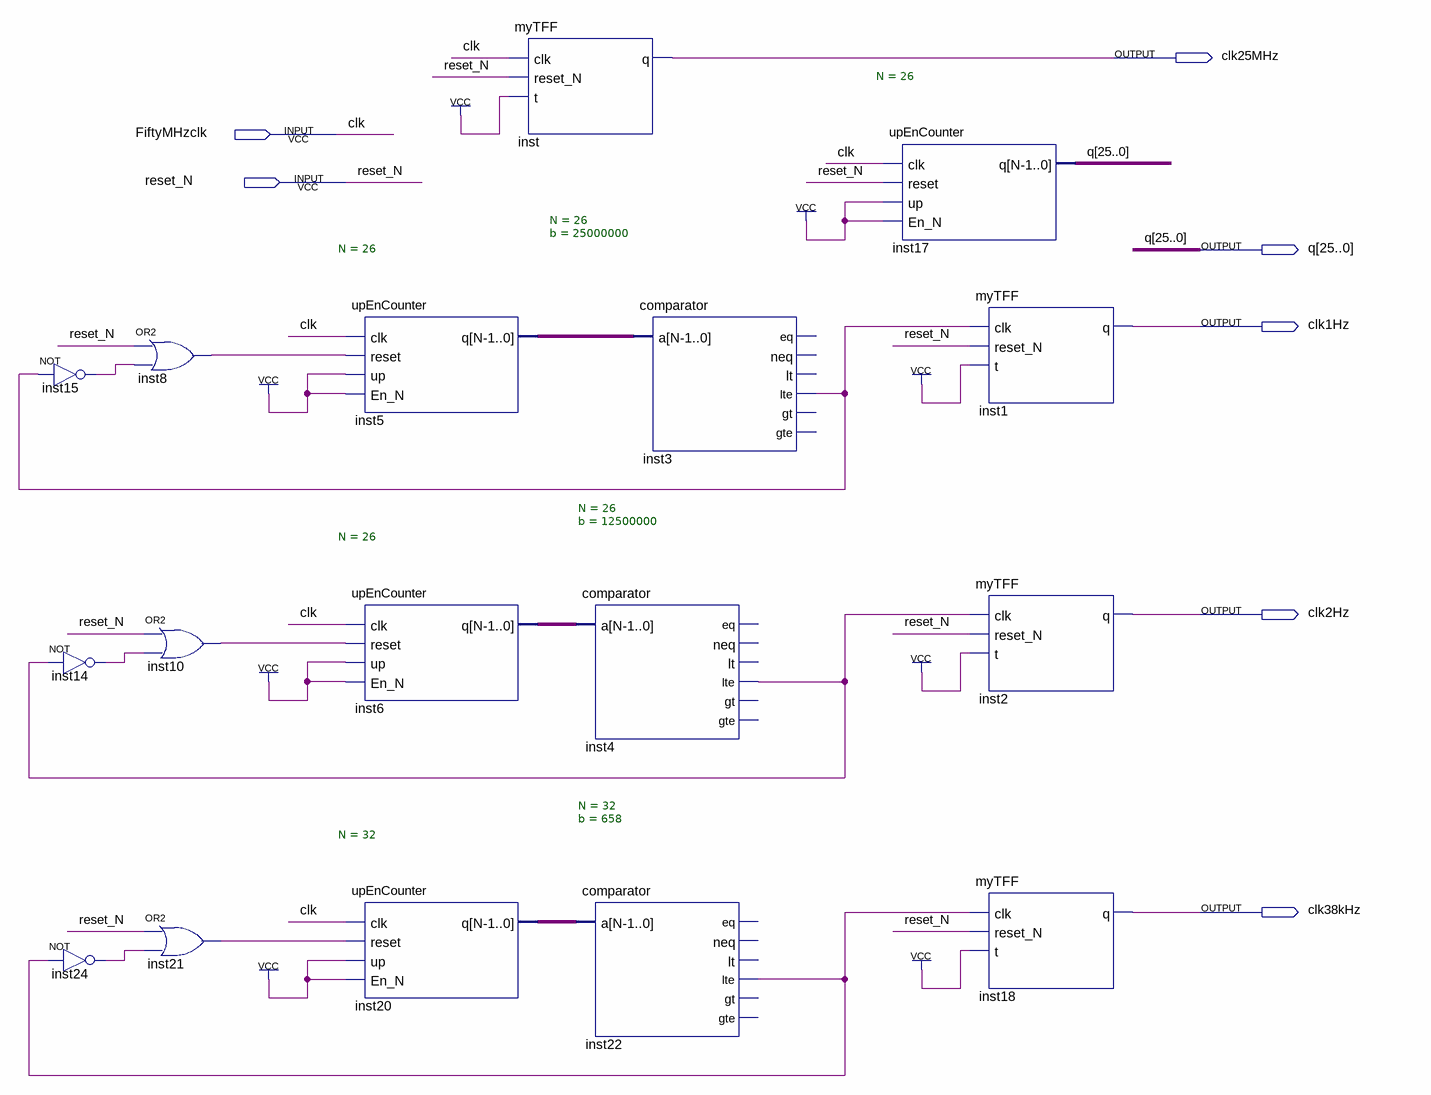
[diagram p0: schematic sheet]
// Quartus schematic clockModule.bdf as structural Verilog: 17 symbols, 7 pins
module clockModule (
  input  FiftyMHzclk,
  input  reset_N,
  output clk25MHz,
  output [25:0] q,
  output clk1Hz,
  output clk2Hz,
  output clk38kHz
);

  wire inst3_lte, inst4_lte, inst8_out, inst10_out, inst14_out, inst15_out, inst21_out, inst22_lte,
       inst24_out;
  wire [25:0] inst5_q, inst6_q;
  wire [31:0] inst20_q;

  not inst15 (inst15_out, inst3_lte);
  not inst14 (inst14_out, inst4_lte);
  not inst24 (inst24_out, inst22_lte);
  or inst8 (inst8_out, reset_N, inst15_out);
  or inst10 (inst10_out, reset_N, inst14_out);
  or inst21 (inst21_out, reset_N, inst24_out);
  upEnCounter #(.N(26)) inst5 (.clk(FiftyMHzclk), .reset(inst8_out), .up(1'b1), .En_N(1'b1), .q(inst5_q));
  upEnCounter #(.N(26)) inst6 (.clk(FiftyMHzclk), .reset(inst10_out), .up(1'b1), .En_N(1'b1), .q(inst6_q));
  upEnCounter #(.N(32)) inst20 (.clk(FiftyMHzclk), .reset(inst21_out), .up(1'b1), .En_N(1'b1), .q(inst20_q));
  myTFF inst (.clk(FiftyMHzclk), .reset_N(reset_N), .t(1'b1), .q(clk25MHz));
  comparator #(.N(26), .b(12500000)) inst4 (.a(inst6_q), .lte(inst4_lte));  // open: eq, neq, lt, gt, gte
  comparator #(.N(32), .b(658)) inst22 (.a(inst20_q), .lte(inst22_lte));  // open: eq, neq, lt, gt, gte
  comparator #(.N(26), .b(25000000)) inst3 (.a(inst5_q), .lte(inst3_lte));  // open: eq, neq, lt, gt, gte
  upEnCounter #(.N(26)) inst17 (.clk(FiftyMHzclk), .reset(reset_N), .up(1'b1), .En_N(1'b1), .q(q));
  myTFF inst1 (.clk(inst3_lte), .reset_N(reset_N), .t(1'b1), .q(clk1Hz));
  myTFF inst2 (.clk(inst4_lte), .reset_N(reset_N), .t(1'b1), .q(clk2Hz));
  myTFF inst18 (.clk(inst22_lte), .reset_N(reset_N), .t(1'b1), .q(clk38kHz));

  // Other names for the same wires on the sheet: clk = FiftyMHzclk
endmodule
